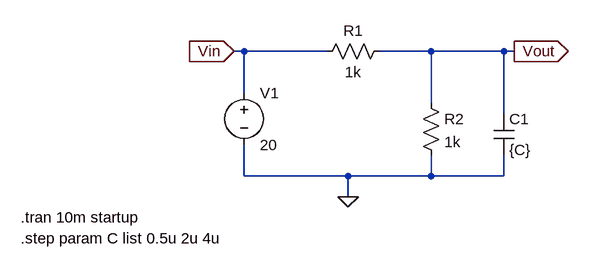
[diagram p0: schematic Draft3.asc]
Draft3.asc, the LTspice schematic file:
Version 4
SHEET 1 880 680
WIRE -16 64 -32 64
WIRE 112 64 -16 64
WIRE 272 64 192 64
WIRE 384 64 272 64
WIRE 400 64 384 64
WIRE -16 128 -16 64
WIRE 272 144 272 64
WIRE 384 160 384 64
WIRE -16 256 -16 208
WIRE 144 256 -16 256
WIRE 272 256 272 224
WIRE 272 256 144 256
WIRE 384 256 384 224
WIRE 384 256 272 256
WIRE 144 288 144 256
FLAG 144 288 0
FLAG -32 64 Vin
IOPIN -32 64 In
FLAG 400 64 Vout
IOPIN 400 64 Out
SYMBOL res 208 48 R90
WINDOW 0 0 56 VBottom 2
WINDOW 3 32 56 VTop 2
SYMATTR InstName R1
SYMATTR Value 1k
SYMBOL res 256 128 R0
SYMATTR InstName R2
SYMATTR Value 1k
SYMBOL cap 368 160 R0
SYMATTR InstName C1
SYMATTR Value {C}
SYMBOL voltage -16 112 R0
WINDOW 123 0 0 Left 0
WINDOW 39 0 0 Left 0
SYMATTR InstName V1
SYMATTR Value 20
TEXT -360 320 Left 2 !.tran 10m startup
TEXT -360 352 Left 2 !.step param C list 0.5u 2u 4u

The netlist it stands for:
* Draft3.asc
R1 Vout Vin 1k
R2 Vout 0 1k
C1 Vout 0 {C}
V1 Vin 0 20
.tran 10m startup
.step param C list 0.5u 2u 4u
.backanno
.end

* Results of the author's LTspice run, read from the files saved beside the schematic
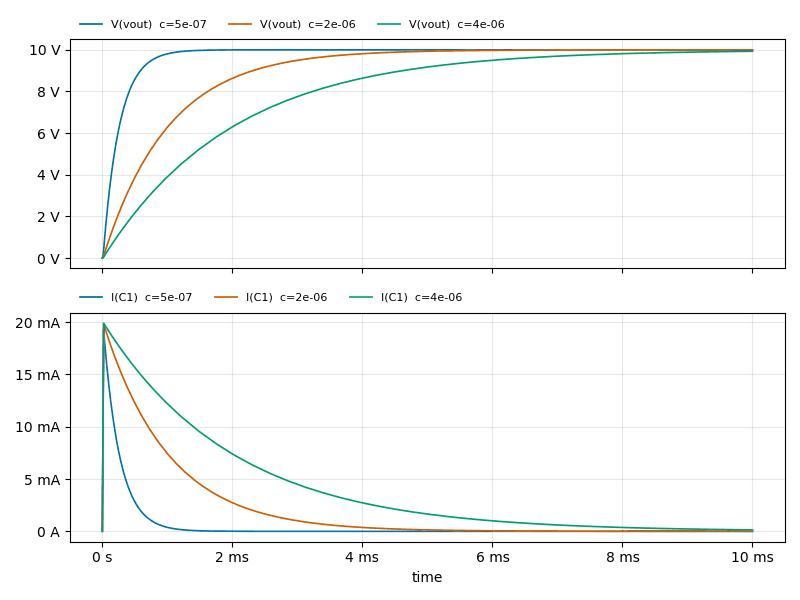
[diagram p1: Transient Analysis of Draft3.asc, plotted from the saved traces]
* Transient Analysis, 3 runs:
*   V(vout) [c=5e-07]: min 0 V, max 10 V, average 9.74 V, rms 9.805 V, last 10 V
*   V(vout) [c=2e-06]: min 0 V, max 10 V, average 8.989 V, rms 9.214 V, last 10 V
*   V(vout) [c=4e-06]: min 0 V, max 9.932 V, average 8.001 V, rms 8.376 V, last 9.932 V
*   I(C1) [c=5e-07]: min 0 A, max 19.22 mA, average 500.5 µA, rms 2.212 mA, last 0 A
*   I(C1) [c=2e-06]: min 0 A, max 19.8 mA, average 2.002 mA, rms 4.465 mA, last 917.1 nA
*   I(C1) [c=4e-06]: min 0 A, max 19.9 mA, average 3.977 mA, rms 6.325 mA, last 135.4 µA